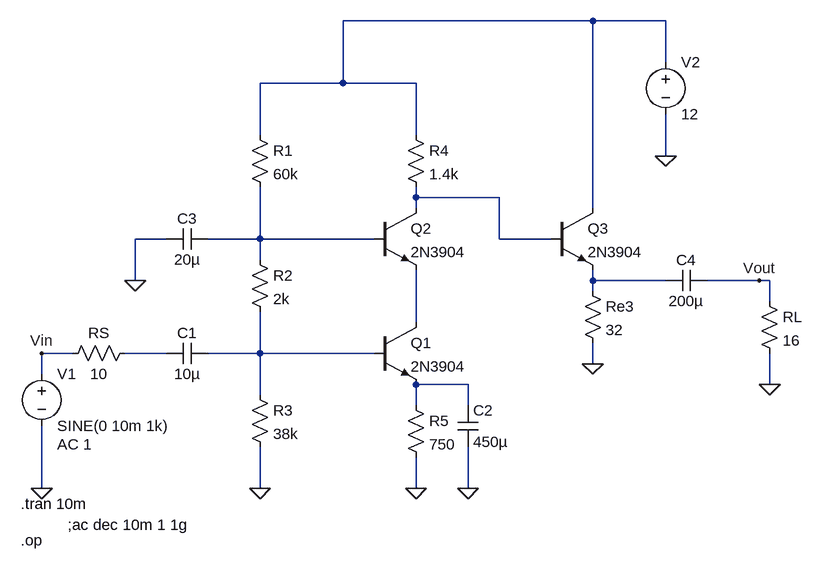
[diagram p0: schematic Cascode.asc]
Cascode.asc, the LTspice schematic file:
Version 4
SHEET 1 1208 680
WIRE 880 -384 496 -384
WIRE 992 -384 880 -384
WIRE 992 -320 992 -384
WIRE 496 -288 496 -384
WIRE 496 -288 368 -288
WIRE 608 -288 496 -288
WIRE 368 -208 368 -288
WIRE 608 -208 608 -288
WIRE 992 -176 992 -240
WIRE 608 -112 608 -128
WIRE 736 -112 608 -112
WIRE 608 -96 608 -112
WIRE 880 -96 880 -384
WIRE 224 -48 176 -48
WIRE 368 -48 368 -128
WIRE 368 -48 288 -48
WIRE 544 -48 368 -48
WIRE 736 -48 736 -112
WIRE 816 -48 736 -48
WIRE 368 -16 368 -48
WIRE 176 16 176 -48
WIRE 880 16 880 0
WIRE 992 16 880 16
WIRE 1136 16 1056 16
WIRE 1152 16 1136 16
WIRE 880 32 880 16
WIRE 1152 48 1152 16
WIRE 608 80 608 0
WIRE 80 128 32 128
WIRE 224 128 160 128
WIRE 368 128 368 64
WIRE 368 128 288 128
WIRE 544 128 368 128
WIRE 880 144 880 112
WIRE 32 160 32 128
WIRE 688 176 608 176
WIRE 1152 176 1152 128
WIRE 368 192 368 128
WIRE 608 208 608 176
WIRE 688 208 688 176
WIRE 32 336 32 240
WIRE 368 336 368 272
WIRE 608 336 608 288
WIRE 688 336 688 272
FLAG 368 336 0
FLAG 608 336 0
FLAG 688 336 0
FLAG 32 336 0
FLAG 32 128 Vin
FLAG 992 -176 0
FLAG 1152 176 0
FLAG 880 144 0
FLAG 176 16 0
FLAG 1136 16 Vout
SYMBOL voltage 32 144 R0
WINDOW 123 24 124 Left 2
WINDOW 39 0 0 Left 0
SYMATTR Value2 AC 1
SYMATTR InstName V1
SYMATTR Value SINE(0 10m 1k)
SYMBOL res 176 112 R90
WINDOW 0 0 56 VBottom 2
WINDOW 3 32 56 VTop 2
SYMATTR InstName RS
SYMATTR Value 10
SYMBOL res 352 -32 R0
SYMATTR InstName R2
SYMATTR Value 2k
SYMBOL res 352 176 R0
SYMATTR InstName R3
SYMATTR Value 38k
SYMBOL npn 544 80 R0
SYMATTR InstName Q1
SYMATTR Value 2N3904
SYMBOL res 592 192 R0
SYMATTR InstName R5
SYMATTR Value 750
SYMBOL cap 672 208 R0
SYMATTR InstName C2
SYMATTR Value 450µ
SYMBOL npn 544 -96 R0
SYMATTR InstName Q2
SYMATTR Value 2N3904
SYMBOL res 352 -224 R0
SYMATTR InstName R1
SYMATTR Value 60k
SYMBOL res 592 -224 R0
SYMATTR InstName R4
SYMATTR Value 1.4k
SYMBOL voltage 992 -336 R0
WINDOW 123 0 0 Left 0
WINDOW 39 0 0 Left 0
SYMATTR InstName V2
SYMATTR Value 12
SYMBOL npn 816 -96 R0
SYMATTR InstName Q3
SYMATTR Value 2N3904
SYMBOL res 1136 32 R0
SYMATTR InstName RL
SYMATTR Value 16
SYMBOL cap 1056 0 R90
WINDOW 0 0 32 VBottom 2
WINDOW 3 32 32 VTop 2
SYMATTR InstName C4
SYMATTR Value 200µ
SYMBOL cap 288 112 R90
WINDOW 0 0 32 VBottom 2
WINDOW 3 32 32 VTop 2
SYMATTR InstName C1
SYMATTR Value 10µ
SYMBOL cap 288 -64 R90
WINDOW 0 0 32 VBottom 2
WINDOW 3 32 32 VTop 2
SYMATTR InstName C3
SYMATTR Value 20µ
SYMBOL res 864 16 R0
SYMATTR InstName Re3
SYMATTR Value 32
TEXT 0 360 Left 2 !.tran 10m
TEXT 72 392 Left 2 !;ac dec 10m 1 1g
TEXT 0 416 Left 2 !.op

The netlist it stands for:
* Cascode.asc
V1 Vin 0 SINE(0 10m 1k) AC 1
RS N006 Vin 10
R2 N003 N007 2k
R3 N007 0 38k
Q1 N005 N007 N008 0 2N3904
R5 N008 0 750
C2 N008 0 450µ
Q2 N002 N003 N005 0 2N3904
R1 N001 N003 60k
R4 N001 N002 1.4k
V2 N001 0 12
Q3 N001 N002 N004 0 2N3904
RL Vout 0 16
C4 Vout N004 200µ
C1 N007 N006 10µ
C3 N003 0 20µ
Re3 N004 0 32
.model NPN NPN
.model PNP PNP
.lib standard.bjt
.tran 10m
;ac dec 10m 1 1g
.op
.backanno
.end